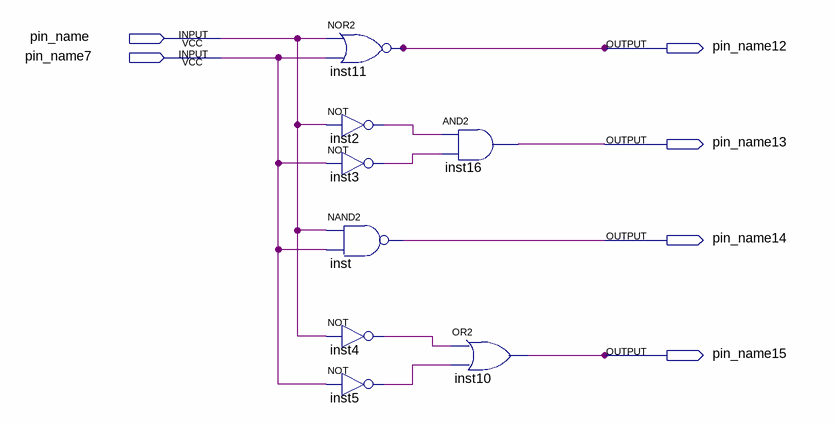
[diagram p0: schematic sheet]
// Quartus schematic 913004.bdf as structural Verilog: 8 symbols, 6 pins
module \913004  (
  input  pin_name,
  input  pin_name7,
  output pin_name12,
  output pin_name13,
  output pin_name14,
  output pin_name15
);

  wire inst2_out, inst3_out, inst4_out, inst5_out;

  nor inst11 (pin_name12, pin_name, pin_name7);
  not inst2 (inst2_out, pin_name);
  not inst3 (inst3_out, pin_name7);
  nand inst (pin_name14, pin_name, pin_name7);
  not inst4 (inst4_out, pin_name);
  not inst5 (inst5_out, pin_name7);
  and inst16 (pin_name13, inst2_out, inst3_out);
  or inst10 (pin_name15, inst4_out, inst5_out);
endmodule
